# Altium schematic sheet Sheet1.SchDoc
size A
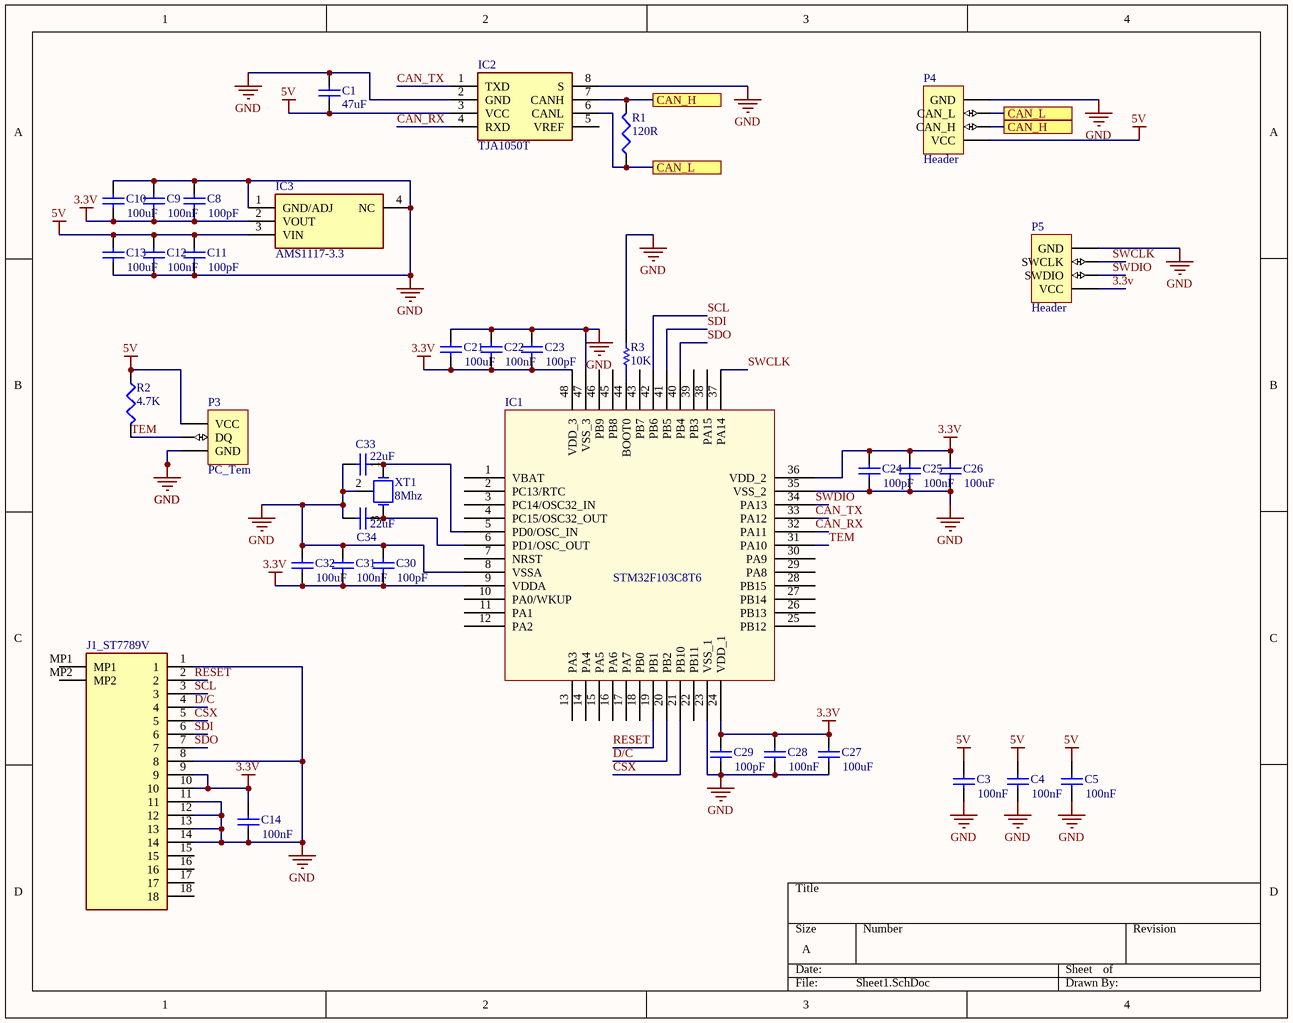
[diagram p0: Sheet1.SchDoc]

## Parts
C1  value 47uF  [C0805]  (hidden comment: Cap Semi)
C3  value 100nF  [C0805]  (hidden comment: Cap Semi)
C4  value 100nF  [C0805]  (hidden comment: Cap Semi)
C5  value 100nF  [C0805]  (hidden comment: Cap Semi)
C8  value 100pF  [C0805]  (hidden comment: Cap Semi)
C9  value 100nF  [C0805]  (hidden comment: Cap Semi)
C10  value 100uF  [C0805]  (hidden comment: Cap Semi)
C11  value 100pF  [C0805]  (hidden comment: Cap Semi)
C12  value 100nF  [C0805]  (hidden comment: Cap Semi)
C13  value 100uF  [C0805]  (hidden comment: Cap Semi)
C14  value 100nF  [C0805]  (hidden comment: Cap Semi)
C21  value 100uF  [C0805]  (hidden comment: Cap Semi)
C22  value 100nF  [C0805]  (hidden comment: Cap Semi)
C23  value 100pF  [C0805]  (hidden comment: Cap Semi)
C24  value 100pF  [C0805]  (hidden comment: Cap Semi)
C25  value 100nF  [C0805]  (hidden comment: Cap Semi)
C26  value 100uF  [C0805]  (hidden comment: Cap Semi)
C27  value 100uF  [C0805]  (hidden comment: Cap Semi)
C28  value 100nF  [C0805]  (hidden comment: Cap Semi)
C29  value 100pF  [C0805]  (hidden comment: Cap Semi)
C30  value 100pF  [C0805]  (hidden comment: Cap Semi)
C31  value 100nF  [C0805]  (hidden comment: Cap Semi)
C32  value 100uF  [C0805]  (hidden comment: Cap Semi)
C33  22uF  [C0805]
C34  22uF  [C0805]
IC1  STM32F103C8T6  [LQFP48]
IC2  TJA1050T  [SOIC127P600X175-8N]
IC3  AMS1117-3.3  [SOT229P700X180-4N]
J1_ST7789V  5034801800  [5034801800]  (value not drawn)
P3  PC_Tem  [HDR1X3]
P4  Header  [HDR1X4]
P5  Header  [HDR1X4]
R1  120R  [R0805]
R2  value 4.7K  [R0805]  (hidden comment: Res3)
R3  10K  [R0805]
XT1  8Mhz  [3225-P]

## Ports
CAN_H, CAN_L

## Nets
3.3v: C8.1 C9.1 C10.1 C14.2 C21.1 C22.1 C23.1 C24.2 C25.2 C26.2 C27.2 C28.2 C29.2 C30.1 C31.1 C32.1 IC1.9(VDDA) IC1.24(VDD_1) IC1.36(VDD_2) IC1.48(VDD_3) IC3.2(VOUT) J1_ST7789V.9 J1_ST7789V.10 P5.1(VCC)
5V: C1.1 C3.2 C4.2 C5.2 C11.2 C12.2 C13.2 IC2.3(VCC) IC3.3(VIN) P3.1(VCC) P4.1(VCC) R2.1
GND: C1.2 C3.1 C4.1 C5.1 C8.2 C9.2 C10.2 C11.1 C12.1 C13.1 C14.1 C21.2 C22.2 C23.2 C24.1 C25.1 C26.1 C27.1 C28.1 C29.1 C30.2 C31.2 C32.2 C33.2 C34.2 IC1.8(VSSA) IC1.23(VSS_1) IC1.35(VSS_2) IC1.47(VSS_3) IC2.2(GND) IC2.8(S) IC3.1(GND/ADJ) IC3.4(NC) J1_ST7789V.1 J1_ST7789V.8 J1_ST7789V.11 J1_ST7789V.12 J1_ST7789V.13 J1_ST7789V.14 P3.3(GND) P4.4(GND) P5.4(GND) R3.2 XT1.2
CAN_H: IC2.7(CANH) P4.2(CAN_H) R1.2 ; port CAN_H
CAN_L: IC2.6(CANL) P4.3(CAN_L) R1.1 ; port CAN_L
CAN_RX: IC1.32(PA11) IC2.4(RXD)
CAN_TX: IC1.33(PA12) IC2.1(TXD)
CSX: IC1.21(PB10) J1_ST7789V.5
D/C: IC1.20(PB2) J1_ST7789V.4
RESET: IC1.19(PB1) J1_ST7789V.2
SCL: IC1.42(PB6) J1_ST7789V.3
SDI: IC1.41(PB5) J1_ST7789V.6
SDO: IC1.40(PB4) J1_ST7789V.7
SWCLK: IC1.37(PA14) P5.3(SWCLK)
SWDIO: IC1.34(PA13) P5.2(SWDIO)
TEM: IC1.31(PA10) P3.2(DQ) R2.2
NetC33_1: C33.1 IC1.5(PD0/OSC_IN) XT1.1(OSC1)
NetC34_1: C34.1 IC1.6(PD1/OSC_OUT) XT1.3(OSC2)
NetIC1_44: IC1.44(BOOT0) R3.1

Not connected (* = marked no-connect by the designer): IC1 1(VBAT) 2(PC13/RTC) 3(PC14/OSC32_IN) 4(PC15/OSC32_OUT) 7(NRST) 10(PA0/WKUP) 11(PA1) 12(PA2) 13(PA3) 14(PA4) 15(PA5) 16(PA6) 17(PA7) 18(PB0) 22(PB11) 25(PB12) 26(PB13) 27(PB14) 28(PB15) 29(PA8) 30(PA9) 38(PA15) 39(PB3) 43(PB7) 45(PB8) 46(PB9); IC2 5(VREF); J1_ST7789V 15 16 17 18 MP1 MP2

## Library data of the parts
C1 C3-C5 C8-C14 C21-C32 = Cap Semi: Capacitor (Semiconductor SIM Model); Published: 8-Jun-2000; LatestRevisionDate: 29-May-2009; LatestRevisionNote: IPC-7351 Footprint Added.; PackageReference: C1206; Publisher: Altium Limited; PackageDescription: Chip Capacitor
C33 C34 = Cap: value: *
IC2 = TJA1050T: Integrated Circuit; Manufacturer_Name: NXP; Datasheet Link: https://datasheet.datasheetarchive.com/originals/distributors/Datasheets-NXP/DSANXP010005907.pdf; Height: 1.75mm; Manufacturer_Part_Number: TJA1050T; Mouser Part Number: N/A; Mouser Price/Stock: https://www.mouser.co.uk/ProductDetail/NXP-Semiconductors/TJA1050T?qs=WhRErS6oET%252B5mtiFrt9ZMQ%3D%3D
IC3 = AMS1117-3.3: Integrated Circuit; Manufacturer_Name: Advanced; Datasheet Link: https://datasheet.datasheetarchive.com/originals/distributors/Datasheets-28/DSA-550594.pdf; Height: 1.8mm; Manufacturer_Part_Number: AMS1117-3.3
J1_ST7789V = 5034801800: Connector; Manufacturer_Name: Molex; Datasheet Link: https://www.arrow.com/en/products/503480-1800/molex; Height: 2.12mm; Manufacturer_Part_Number: 5034801800; Arrow Part Number: 5034801800; Arrow Price/Stock: https://www.arrow.com/en/products/503480-1800/molex?region=nac
P3 = Header 3: LatestRevisionDate: 17-Jul-2002; LatestRevisionNote: Re-released for DXP Platform.; Publisher: Altium Limited
P4 = Header 4: to debug; LatestRevisionDate: 17-Jul-2002; LatestRevisionNote: Re-released for DXP Platform.; Publisher: Altium Limited
P5 = Header 4: LatestRevisionDate: 17-Jul-2002; LatestRevisionNote: Re-released for DXP Platform.; Publisher: Altium Limited
R1 R2 = Res3: Resistor; Published: 8-Jun-2000; LatestRevisionDate: 29-May-2009; LatestRevisionNote: IPC-7351 Footprint Added.; PackageReference: J1-0603; Publisher: Altium Limited; PackageDescription: Chip Resistor
  R1: Value: 120R
R3 = Resistor_1: value: *
XT1 = Passive Crystal: frequency: *